# Altium project Sumobot 2007.PRJPCB
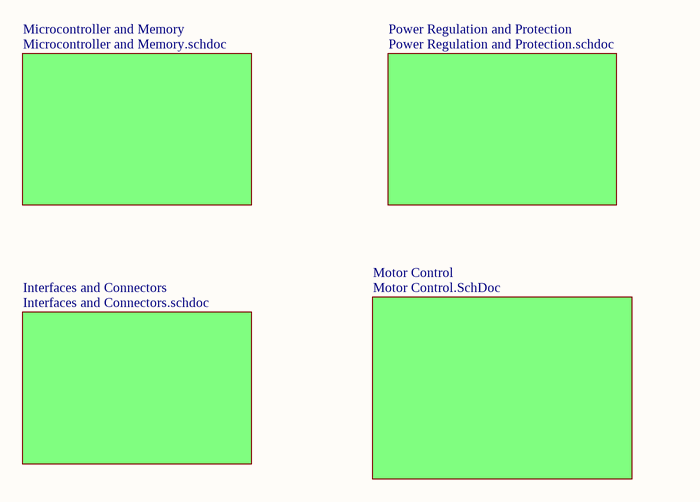
[diagram p0: Schematic of Schematics.SCHDOC]
5 sheets, 97 parts. Net scope: global (net labels, ports and power ports of the same name join across sheets).
Board files: PCB Layout.PCBDOC, SumoPCB.PcbDoc
Sheets:
  Schematic of Schematics.SCHDOC
    Microcontroller and Memory = Microcontroller and Memory.SCHDOC
    Interfaces and Connectors = Interfaces and Connectors.SCHDOC
    Power Regulation and Protection = Power Regulation and Protection.SCHDOC
    Motor Control = Motor Control.SchDoc

## Sheet Schematic of Schematics.SCHDOC
size A4

### Sub-sheets
Interfaces and Connectors = Interfaces and Connectors.schdoc: no entries
Microcontroller and Memory = Microcontroller and Memory.schdoc: no entries
Motor Control = Motor Control.SchDoc: no entries
Power Regulation and Protection = Power Regulation and Protection.schdoc: no entries

## Sheet Microcontroller and Memory.SCHDOC
size A3
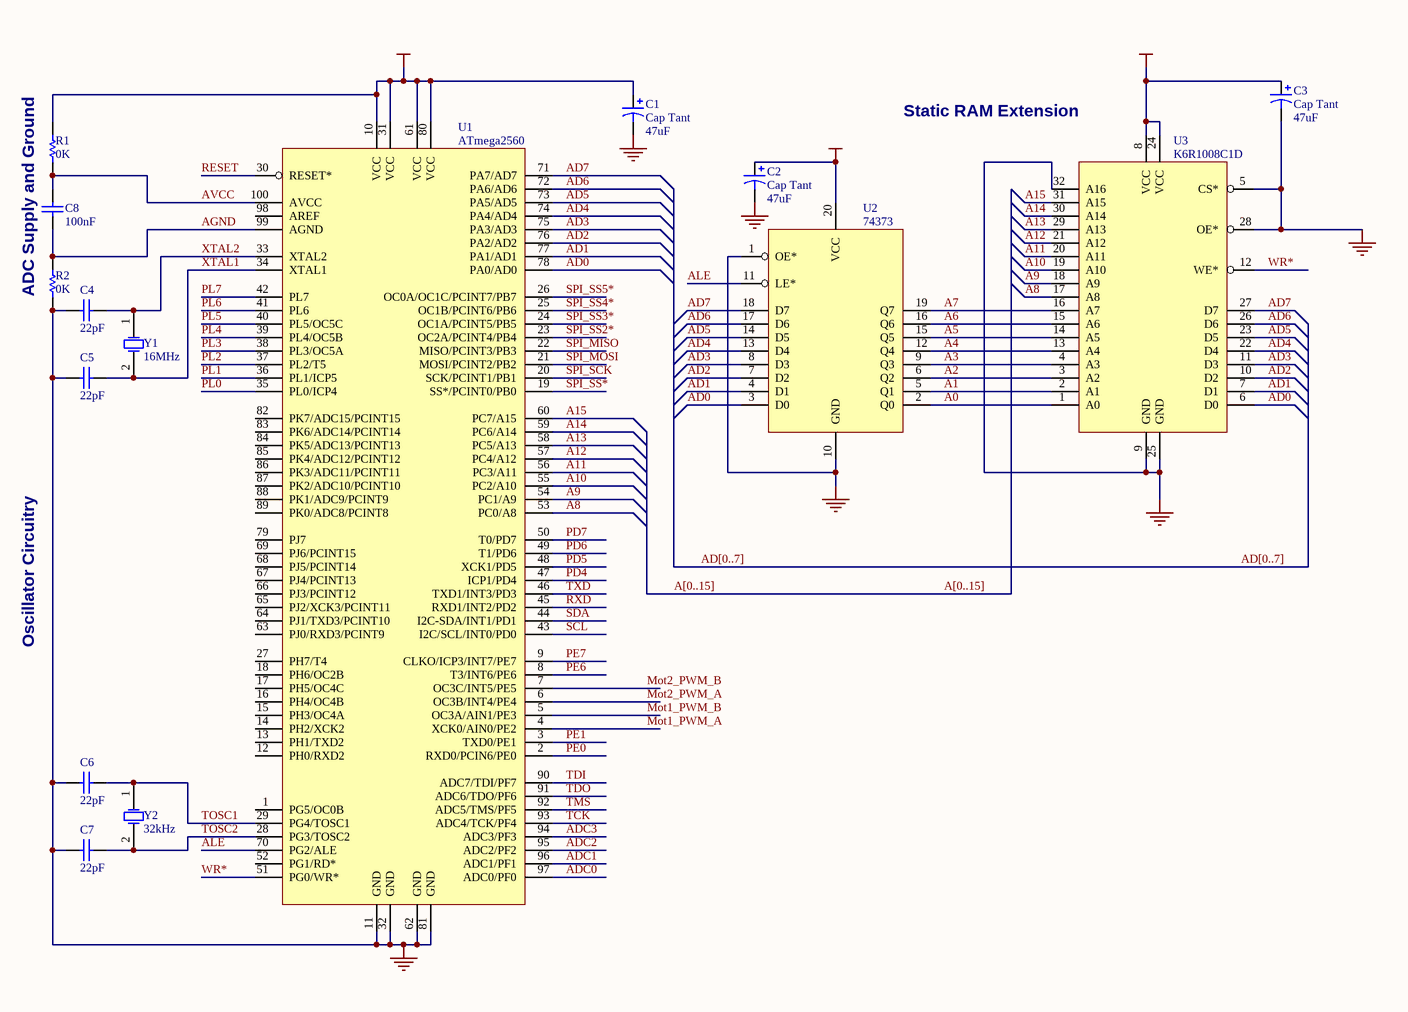
[diagram p1: Microcontroller and Memory.SCHDOC]

### Parts
C1  Cap Tant  value 47uF  [CAPR5-4X5]
C2  Cap Tant  value 47uF  [CAPR5-4X5]
C3  Cap Tant  value 47uF  [CAPR5-4X5]
C4  22pF  [BCY-W2/D3.1]
C5  22pF  [BCY-W2/D3.1]
C6  22pF  [BCY-W2/D3.1]
C7  22pF  [BCY-W2/D3.1]
C8  100nF  [BCY-W2/D3.1]
R1  0K  [AXIAL-0.3]
R2  0K  [AXIAL-0.3]
U1  ATmega2560  [F-QFP14X14-G100/Z17N]
U2  74373  [SO-G20/Y1.45]
U3  K6R1008C1D  [SO-G32/Y1.45]
Y1  16MHz  [BCY-W2/D3.1]
Y2  32kHz  [BCY-W2/D3.1]

### Nets
5V: C1.1 C2.1 C3.1 R1.2 U1.10(VCC) U1.31(VCC) U1.61(VCC) U1.80(VCC) U2.20(VCC) U3.8(VCC) U3.24(VCC)
GND: C1.2 C2.2 C3.2 C4.1 C5.1 C6.1 C7.1 R2.1 U1.11(GND) U1.32(GND) U1.62(GND) U1.81(GND) U2.1(OE*) U2.10(GND) U3.5(CS*) U3.9(GND) U3.25(GND) U3.28(OE*) U3.32(A16)
A0: U2.2(Q0) U3.1(A0)
A1: U2.5(Q1) U3.2(A1)
A2: U2.6(Q2) U3.3(A2)
A3: U2.9(Q3) U3.4(A3)
A4: U2.12(Q4) U3.13(A4)
A5: U2.15(Q5) U3.14(A5)
A6: U2.16(Q6) U3.15(A6)
A7: U2.19(Q7) U3.16(A7)
A8: U1.53(PC0/A8) U3.17(A8)
A9: U1.54(PC1/A9) U3.18(A9)
A10: U1.55(PC2/A10) U3.19(A10)
A11: U1.56(PC3/A11) U3.20(A11)
A12: U1.57(PC4/A12) U3.21(A12)
A13: U1.58(PC5/A13) U3.29(A13)
A14: U1.59(PC6/A14) U3.30(A14)
A15: U1.60(PC7/A15) U3.31(A15)
AD0: U1.78(PA0/AD0) U2.3(D0) U3.6(D0)
AD1: U1.77(PA1/AD1) U2.4(D1) U3.7(D1)
AD2: U1.76(PA2/AD2) U2.7(D2) U3.10(D2)
AD3: U1.75(PA3/AD3) U2.8(D3) U3.11(D3)
AD4: U1.74(PA4/AD4) U2.13(D4) U3.22(D4)
AD5: U1.73(PA5/AD5) U2.14(D5) U3.23(D5)
AD6: U1.72(PA6/AD6) U2.17(D6) U3.26(D6)
AD7: U1.71(PA7/AD7) U2.18(D7) U3.27(D7)
ADC0: U1.97(ADC0/PF0)
ADC1: U1.96(ADC1/PF1)
ADC2: U1.95(ADC2/PF2)
ADC3: U1.94(ADC3/PF3)
AGND: C8.2 R2.2 U1.99(AGND)
ALE: U1.70(PG2/ALE) U2.11(LE*)
AVCC: C8.1 R1.1 U1.100(AVCC)
Mot1_PWM_A: U1.4(XCK0/AIN0/PE2)
Mot1_PWM_B: U1.5(OC3A/AIN1/PE3)
Mot2_PWM_A: U1.6(OC3B/INT4/PE4)
Mot2_PWM_B: U1.7(OC3C/INT5/PE5)
PD4: U1.47(ICP1/PD4)
PD5: U1.48(XCK1/PD5)
PD6: U1.49(T1/PD6)
PD7: U1.50(T0/PD7)
PE0: U1.2(RXD0/PCIN6/PE0)
PE1: U1.3(TXD0/PE1)
PE6: U1.8(T3/INT6/PE6)
PE7: U1.9(CLKO/ICP3/INT7/PE7)
PL0: U1.35(PL0/ICP4)
PL1: U1.36(PL1/ICP5)
PL2: U1.37(PL2/T5)
PL3: U1.38(PL3/OC5A)
PL4: U1.39(PL4/OC5B)
PL5: U1.40(PL5/OC5C)
PL6: U1.41(PL6)
PL7: U1.42(PL7)
RESET: U1.30(RESET*)
RXD: U1.45(RXD1/INT2/PD2)
SCL: U1.43(I2C/SCL/INT0/PD0)
SDA: U1.44(I2C-SDA/INT1/PD1)
SPI_MISO: U1.22(MISO/PCINT3/PB3)
SPI_MOSI: U1.21(MOSI/PCINT2/PB2)
SPI_SCK: U1.20(SCK/PCINT1/PB1)
SPI_SS2*: U1.23(OC2A/PCINT4/PB4)
SPI_SS3*: U1.24(OC1A/PCINT5/PB5)
SPI_SS4*: U1.25(OC1B/PCINT6/PB6)
SPI_SS5*: U1.26(OC0A/OC1C/PCINT7/PB7)
SPI_SS*: U1.19(SS*/PCINT0/PB0)
TCK: U1.93(ADC4/TCK/PF4)
TDI: U1.90(ADC7/TDI/PF7)
TDO: U1.91(ADC6/TDO/PF6)
TMS: U1.92(ADC5/TMS/PF5)
TOSC1: C6.2 U1.29(PG4/TOSC1) Y2.1(OSC1)
TOSC2: C7.2 U1.28(PG3/TOSC2) Y2.2(OSC2)
TXD: U1.46(TXD1/INT3/PD3)
WR*: U1.51(PG0/WR*) U3.12(WE*)
XTAL1: C5.2 U1.34(XTAL1) Y1.2(OSC2)
XTAL2: C4.2 U1.33(XTAL2) Y1.1(OSC1)

Not connected (* = marked no-connect by the designer): U1 1(PG5/OC0B) 12(PH0/RXD2) 13(PH1/TXD2) 14(PH2/XCK2) 15(PH3/OC4A) 16(PH4/OC4B) 17(PH5/OC4C) 18(PH6/OC2B) 27(PH7/T4) 52(PG1/RD*) 63(PJ0/RXD3/PCINT9) 64(PJ1/TXD3/PCINT10) 65(PJ2/XCK3/PCINT11) 66(PJ3/PCINT12) 67(PJ4/PCINT13) 68(PJ5/PCINT14) 69(PJ6/PCINT15) 79(PJ7) 82(PK7/ADC15/PCINT15) 83(PK6/ADC14/PCINT14) 84(PK5/ADC13/PCINT13) 85(PK4/ADC12/PCINT12) 86(PK3/ADC11/PCINT11) 87(PK2/ADC10/PCINT10) 88(PK1/ADC9/PCINT9) 89(PK0/ADC8/PCINT8) 98(AREF)

### Buses and harness runs
bus A[0..15]
bus AD[0..7]

### Notes on the sheet
- (near U3) Static RAM Extension
- ADC Supply and Ground
- Oscillator Circuitry

### Library data of the parts
C1-C3 = Cap Pol2: Polarized Capacitor (Axial); Published: 8-Jun-2000; Revision: July-2002: Re-released for DXP Platform.; Publisher: Altium Limited
C4-C8 = Cap: Capacitor; Published: 8-Jun-2000; Revision: July-2002: Re-released for DXP Platform.; Publisher: Altium Limited
R1 R2 = Res1: Resistor; Published: 8-Jun-2000; Revision: July-2002: Re-released for DXP Platform.; Publisher: Altium Limited
U1 = ATmega2560: Atmel ATmega2560 MCU
U2 = 74373: Octal 8-bit D-type Latch
U3 = K6R1008C1D: Samsung 128Kx8 High-Speed Static RAM
Y1 Y2 = XTAL: Crystal Oscillator; Published: 8-Jun-2000; Revision: July-2002: Re-released for DXP Platform.; Publisher: Altium Limited

## Sheet Interfaces and Connectors.SCHDOC
size A4
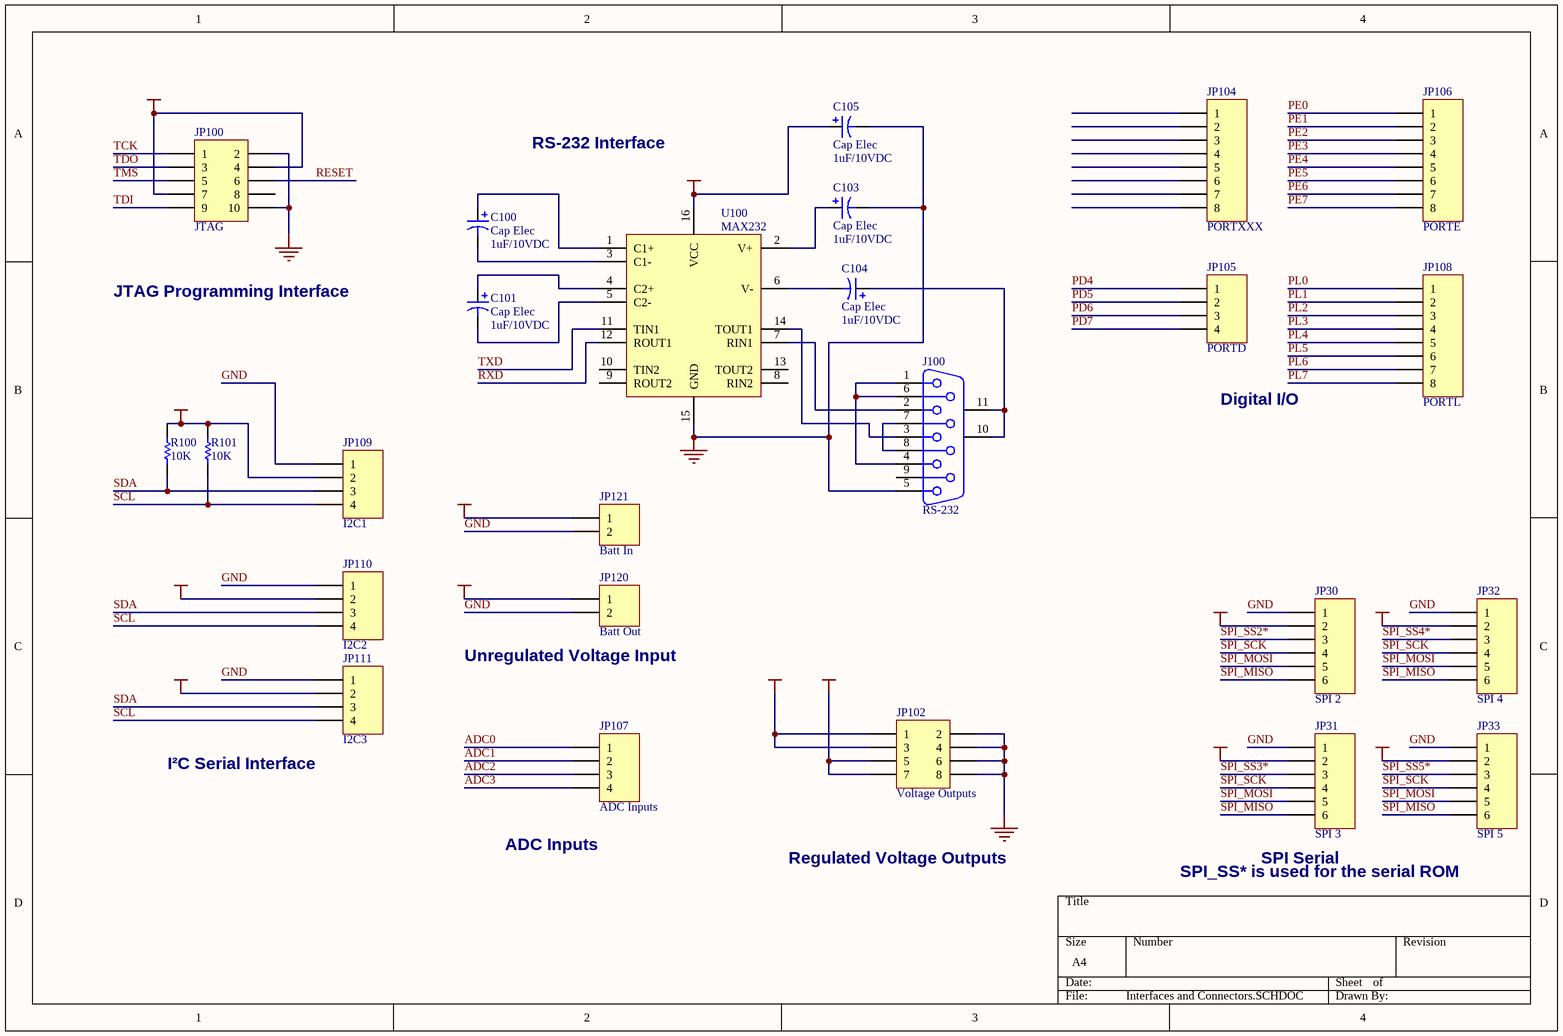
[diagram p2: Interfaces and Connectors.SCHDOC]

### Parts
C100  Cap Elec  value 1uF/10VDC  [CAPR5-4X5]
C101  Cap Elec  value 1uF/10VDC  [CAPR5-4X5]
C103  Cap Elec  value 1uF/10VDC  [CAPR5-4X5]
C104  Cap Elec  value 1uF/10VDC  [CAPR5-4X5]
C105  Cap Elec  value 1uF/10VDC  [CAPR5-4X5]
J100  RS-232  [DSUB1.385-2H9]
JP30  SPI 2  [HDR1X6]
JP31  SPI 3  [HDR1X6]
JP32  SPI 4  [HDR1X6]
JP33  SPI 5  [HDR1X6]
JP100  JTAG  [HDR2X5]
JP102  Voltage Outputs  [HDR2X4]
JP104  PORTXXX  [HDR1X8]
JP105  PORTD  [HDR1X4]
JP106  PORTE  [HDR1X8]
JP107  ADC Inputs  [HDR1X4]
JP108  PORTL  [HDR1X8]
JP109  I2C1  [HDR1X4]
JP110  I2C2  [HDR1X4]
JP111  I2C3  [HDR1X4]
JP120  Batt Out  [HDR1X2]
JP121  Batt In  [HDR1X2]
R100  10K  [AXIAL-0.3]
R101  10K  [AXIAL-0.3]
U100  MAX232  [SO-G16/C5.85]

### Nets
5V: C105.1 JP30.2 JP31.2 JP32.2 JP33.2 JP100.4 JP100.7 JP102.5 JP102.7 JP109.2 JP110.2 JP111.2 R100.2 R101.2 U100.16(VCC)
9V: JP102.1 JP102.3
GND: C103.2 C105.2 J100.5 JP30.1 JP31.1 JP32.1 JP33.1 JP100.2 JP100.10 JP102.2 JP102.4 JP102.6 JP102.8 JP109.1 JP110.1 JP111.1 JP120.2 JP121.2 U100.15(GND)
VBat: JP120.1 JP121.1
ADC0: JP107.1
ADC1: JP107.2
ADC2: JP107.3
ADC3: JP107.4
PD4: JP105.1
PD5: JP105.2
PD6: JP105.3
PD7: JP105.4
PE0: JP106.1
PE1: JP106.2
PE2: JP106.3
PE3: JP106.4
PE4: JP106.5
PE5: JP106.6
PE6: JP106.7
PE7: JP106.8
PL0: JP108.1
PL1: JP108.2
PL2: JP108.3
PL3: JP108.4
PL4: JP108.5
PL5: JP108.6
PL6: JP108.7
PL7: JP108.8
RESET: JP100.6
RXD: U100.12(ROUT1)
SCL: JP109.4 JP110.4 JP111.4 R101.1
SDA: JP109.3 JP110.3 JP111.3 R100.1
SPI_MISO: JP30.6 JP31.6 JP32.6 JP33.6
SPI_MOSI: JP30.5 JP31.5 JP32.5 JP33.5
SPI_SCK: JP30.4 JP31.4 JP32.4 JP33.4
SPI_SS2*: JP30.3
SPI_SS3*: JP31.3
SPI_SS4*: JP32.3
SPI_SS5*: JP33.3
TCK: JP100.1
TDI: JP100.9
TDO: JP100.3
TMS: JP100.5
TXD: U100.11(TIN1)
NetC100_1: C100.1 U100.1(C1+)
NetC100_2: C100.2 U100.3(C1-)
NetC101_1: C101.1 U100.4(C2+)
NetC101_2: C101.2 U100.5(C2-)
NetC103_1: C103.1 U100.2(V+)
NetC104_1: C104.1 J100.10(MH1) J100.11(MH2)
NetC104_2: C104.2 U100.6(V-)
NetJ100_1: J100.1 J100.4 J100.6
NetJ100_2: J100.2 U100.7(RIN1)
NetJ100_3: J100.3 U100.14(TOUT1)
NetJ100_7: J100.7 J100.8

Not connected (* = marked no-connect by the designer): J100 9; JP100 8; JP104 1 2 3 4 5 6 7 8; U100 8(RIN2) 9(ROUT2) 10(TIN2) 13(TOUT2)

### Notes on the sheet
- RS-232 Interface
- JTAG Programming Interface
- Digital I/O
- (near JP120) Unregulated Voltage Input
- (near JP111) I²C Serial Interface
- (near JP107) ADC Inputs
- Regulated Voltage Outputs
- SPI_SS* is used for the serial ROM
- (near JP31) SPI Serial

### Library data of the parts
C100 C101 C103-C105 = Cap Pol2: Polarized Capacitor (Axial); Published: 8-Jun-2000; Revision: July-2002: Re-released for DXP Platform.; Publisher: Altium Limited
J100 = D Connector 9: Receptacle Assembly, 9 Position, Right Angle; Package Information: Latest Revision: O; Positions: 9; Published: 15-Jun-2001; Revision: 17-Jul-2002: Re-released for DXP Platform.; Datasheet: (1-Sep-1999); Package Reference: 788750; Publisher: Altium Limited; Orientation: Right Angle; Gender: Receptacle
JP30-JP33 = Header 6: Header, 6-Pin; Revision: 17-Jul-2002: Re-released for DXP Platform.; Publisher: Altium Limited
JP100 = Header 5X2: Header, 5-Pin, Dual row; Revision: 17-Jul-2002: Re-released for DXP Platform.; Publisher: Altium Limited
JP102 = Header 4X2: Header, 4-Pin, Dual row; Revision: 17-Jul-2002: Re-released for DXP Platform.; Publisher: Altium Limited
JP104 JP106 JP108 = Header 8: Header, 8-Pin; Revision: 17-Jul-2002: Re-released for DXP Platform.; Publisher: Altium Limited
JP105 JP107 JP109-JP111 = Header 4: Header, 4-Pin; Revision: 17-Jul-2002: Re-released for DXP Platform.; Publisher: Altium Limited
JP120 JP121 = Header 2: Header, 2-Pin; Revision: 17-Jul-2002: Re-released for DXP Platform.; Publisher: Altium Limited
R100 R101 = Res1: Resistor; Published: 8-Jun-2000; Revision: July-2002: Re-released for DXP Platform.; Publisher: Altium Limited
U100 = MAX232: Maxim RS-232 Transceiver

## Sheet Power Regulation and Protection.SCHDOC
size A4
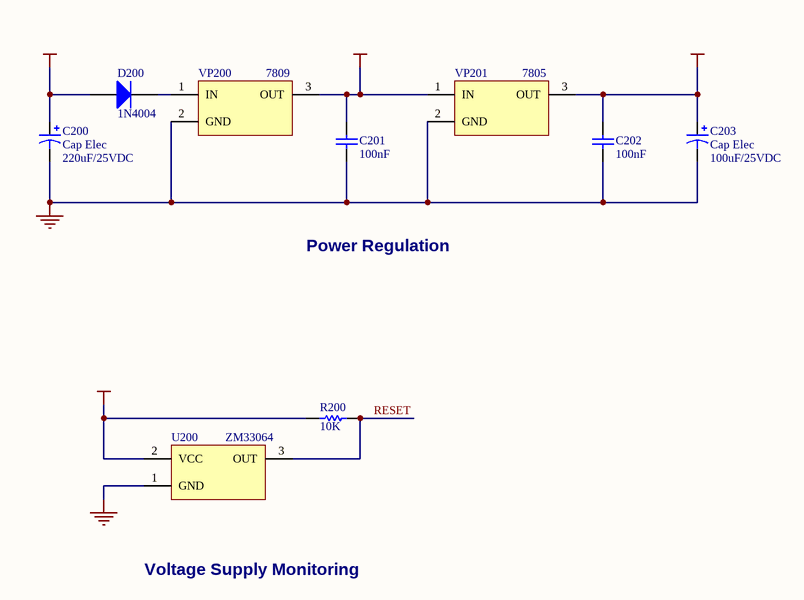
[diagram p3: Power Regulation and Protection.SCHDOC]

### Parts
C200  Cap Elec  value 220uF/25VDC  [CAPR5-4X5]
C201  100nF  [BCY-W2/D3.1]
C202  100nF  [BCY-W2/D3.1]
C203  Cap Elec  value 100uF/25VDC  [CAPR5-4X5]
D200  1N4004  [DIO10.46-5.3x2.8]
R200  10K  [AXIAL-0.3]
U200  ZM33064  [BCY-W3]
VP200  7809  [PIN3]
VP201  7805  [PIN3]

### Nets
5V: C202.2 C203.1 R200.2 U200.2(VCC) VP201.3(OUT)
9V: C201.2 VP200.3(OUT) VP201.1(IN)
GND: C200.2 C201.1 C202.1 C203.2 U200.1(GND) VP200.2(GND) VP201.2(GND)
VBat: C200.1 D200.1(A)
RESET: R200.1 U200.3(OUT)
NetD200_2: D200.2(K) VP200.1(IN)

### Notes on the sheet
- Power Regulation
- Voltage Supply Monitoring

### Library data of the parts
C200 C203 = Cap Pol2: Polarized Capacitor (Axial); Published: 8-Jun-2000; Revision: July-2002: Re-released for DXP Platform.; Publisher: Altium Limited
C201 C202 = Cap: Capacitor; Published: 8-Jun-2000; Revision: July-2002: Re-released for DXP Platform.; Publisher: Altium Limited
D200 = Diode 1N4004: 1 Amp General Purpose Rectifier; Revision 1: 11-Jul-2000: SIM Model Added.; Revision 2: 17-Jul-2002: Re-released for DXP Platform.; Package Information: Latest Revision: Aug-1999; Code - JEDEC: DO-204-AL; Published: 8-Jun-2000; Datasheet: Latest Revision: 1998; Package Reference: DO-41; Publisher: Altium Limited
R200 = Res1: Resistor; Published: 8-Jun-2000; Revision: July-2002: Re-released for DXP Platform.; Publisher: Altium Limited
U200 = ZM33064: Generic 5V Supply Voltage Monitor
VP200 = 7809: Generic 9V Voltage Regulator
VP201 = 7805: Generic 6V Voltage Regulator

## Sheet Motor Control.SchDoc
size A3
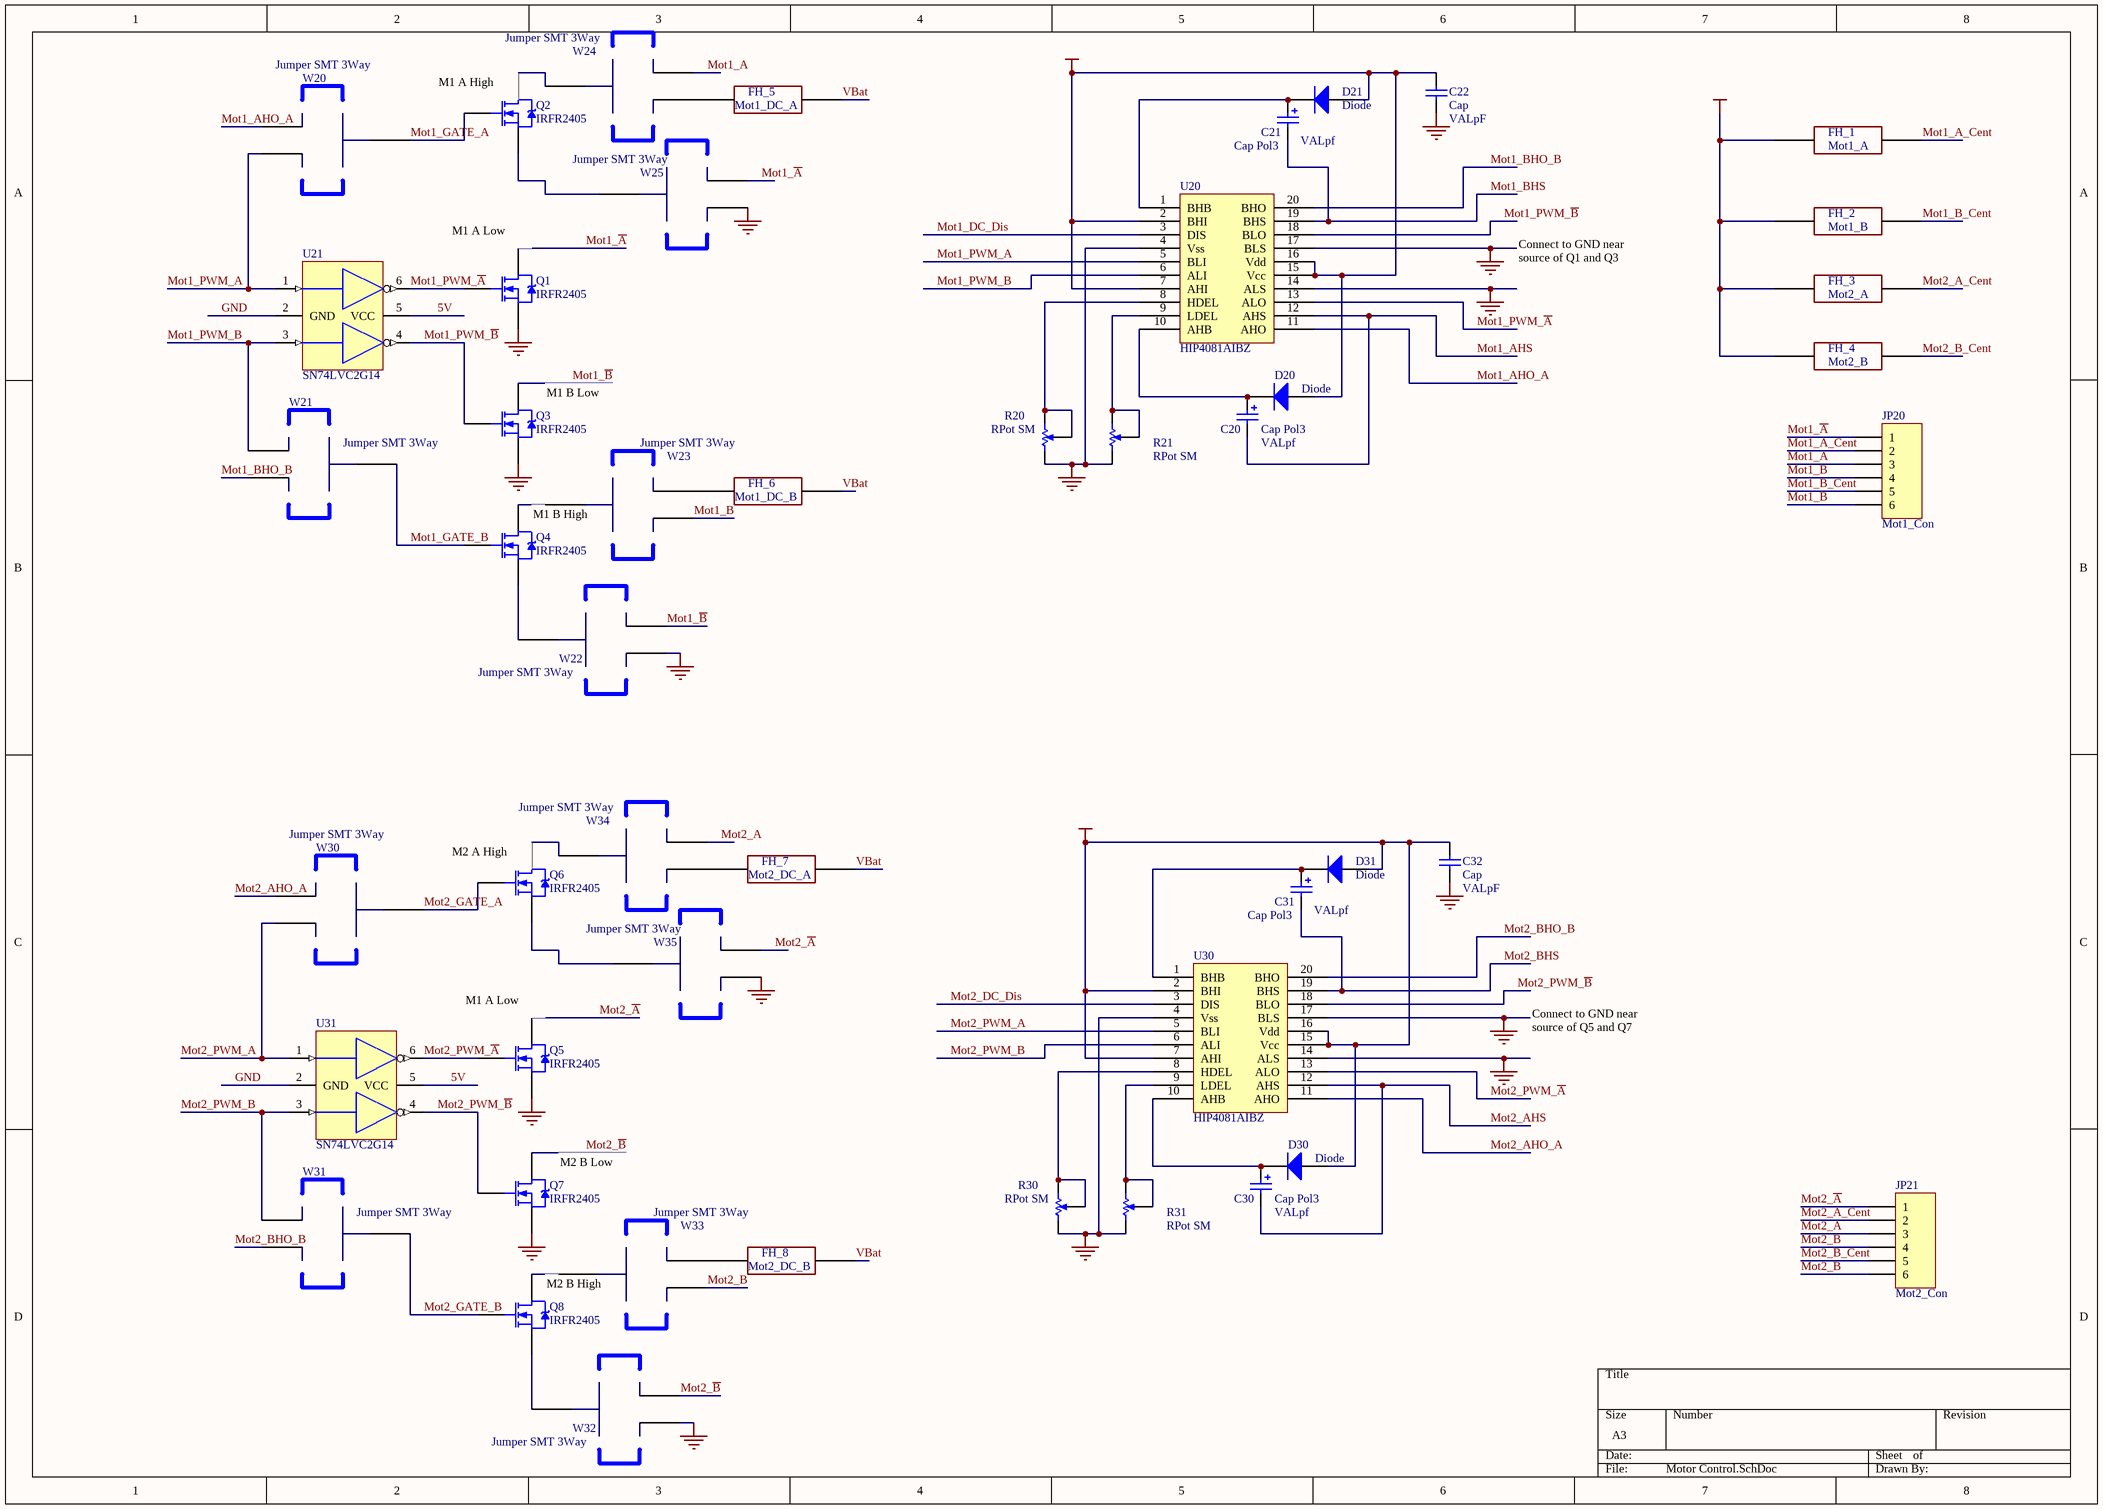
[diagram p4: Motor Control.SchDoc]

### Parts
C20  Cap Pol3  value VALpf  [CC2012-0805]
C21  Cap Pol3  value VALpf  [CC2012-0805]
C22  Cap  value VALpF  [RAD-0.3]
C30  Cap Pol3  value VALpf  [CC2012-0805]
C31  Cap Pol3  value VALpf  [CC2012-0805]
C32  Cap  value VALpF  [RAD-0.3]
D20  Diode  [DSO-C2/X3.3]
D21  Diode  [DSO-C2/X3.3]
D30  Diode  [DSO-C2/X3.3]
D31  Diode  [DSO-C2/X3.3]
FH_1  Mot1_A
FH_2  Mot1_B
FH_3  Mot2_A
FH_4  Mot2_B
FH_5  Mot1_DC_A
FH_6  Mot1_DC_B
FH_7  Mot2_DC_A
FH_8  Mot2_DC_B
JP20  Mot1_Con  [HDR1X6]
JP21  Mot2_Con  [HDR1X6]
Q1  IRFR2405  [TO-252AA]
Q2  IRFR2405  [TO-252AA]
Q3  IRFR2405  [TO-252AA]
Q4  IRFR2405  [TO-252AA]
Q5  IRFR2405  [TO-252AA]
Q6  IRFR2405  [TO-252AA]
Q7  IRFR2405  [TO-252AA]
Q8  IRFR2405  [TO-252AA]
R20  RPot SM  [POT4MM-2]
R21  RPot SM  [POT4MM-2]
R30  RPot SM  [POT4MM-2]
R31  RPot SM  [POT4MM-2]
U20  HIP4081AIBZ  [SOIC20A]
U21  SN74LVC2G14  [SC70]
U30  HIP4081AIBZ  [SOIC20A]
U31  SN74LVC2G14  [SC70]
W20  Jumper SMT 3Way  [Jumper SMT 3 Way]
W21  Jumper SMT 3Way  [Jumper SMT 3 Way]
W22  Jumper SMT 3Way  [Jumper SMT 3 Way]
W23  Jumper SMT 3Way  [Jumper SMT 3 Way]
W24  Jumper SMT 3Way  [Jumper SMT 3 Way]
W25  Jumper SMT 3Way  [Jumper SMT 3 Way]
W30  Jumper SMT 3Way  [Jumper SMT 3 Way]
W31  Jumper SMT 3Way  [Jumper SMT 3 Way]
W32  Jumper SMT 3Way  [Jumper SMT 3 Way]
W33  Jumper SMT 3Way  [Jumper SMT 3 Way]
W34  Jumper SMT 3Way  [Jumper SMT 3 Way]
W35  Jumper SMT 3Way  [Jumper SMT 3 Way]

### Nets
5V: U21.5(VCC) U31.5(VCC)
12V: C22.2 C32.2 D20.1(A) D21.1(A) D30.1(A) D31.1(A) U20.2(BHI) U20.7(AHI) U20.15(Vcc) U20.16(Vdd) U30.2(BHI) U30.7(AHI) U30.15(Vcc) U30.16(Vdd)
GND: C22.1 C32.1 Q1.3(S) Q3.3(S) Q5.3(S) Q7.3(S) R20.CCW(-) R21.CCW(-) R30.CCW(-) R31.CCW(-) U20.4(Vss) U20.14(ALS) U20.17(BLS) U21.2(GND) U30.4(Vss) U30.14(ALS) U30.17(BLS) U31.2(GND) W22.3(Out2) W25.3(Out2) W32.3(Out2) W35.3(Out2)
VBat: FH_1.1 FH_2.1 FH_3.1 FH_4.1 FH_5.2 FH_6.2 FH_7.2 FH_8.2
Mot1_A: JP20.3 W24.2(Out1)
Mot1_~{A}: JP20.1 Q1.4(D) W25.2(Out1)
Mot1_A_Cent: FH_1.2 JP20.2
Mot1_AHO_A: U20.11(AHO) W20.3(Out2)
Mot1_AHS: C20.2 U20.12(AHS)
Mot1_B: JP20.6 W23.3(Out2)
Mot1_~{B}: JP20.4 Q3.4(D) W22.2(Out1)
Mot1_B_Cent: FH_2.2 JP20.5
Mot1_BHO_B: U20.20(BHO) W21.2(Out1)
Mot1_BHS: C21.2 U20.19(BHS)
Mot1_DC_Dis: U20.3(DIS)
Mot1_GATE_A: Q2.1(G) W20.1(In)
Mot1_GATE_B: Q4.1(G) W21.1(In)
Mot1_PWM_A: U20.5(BLI) U21.1(A) W20.2(Out1)
Mot1_PWM_~{A}: Q1.1(G) U20.13(ALO) U21.6(Y)
Mot1_PWM_B: U20.6(ALI) U21.3(A) W21.3(Out2)
Mot1_PWM_~{B}: Q3.1(G) U20.18(BLO) U21.4(Y)
Mot2_A: JP21.3 W34.2(Out1)
Mot2_~{A}: JP21.1 Q5.4(D) W35.2(Out1)
Mot2_A_Cent: FH_3.2 JP21.2
Mot2_AHO_A: U30.11(AHO) W30.3(Out2)
Mot2_AHS: C30.2 U30.12(AHS)
Mot2_B: JP21.6 W33.3(Out2)
Mot2_~{B}: JP21.4 Q7.4(D) W32.2(Out1)
Mot2_B_Cent: FH_4.2 JP21.5
Mot2_BHO_B: U30.20(BHO) W31.2(Out1)
Mot2_BHS: C31.2 U30.19(BHS)
Mot2_DC_Dis: U30.3(DIS)
Mot2_GATE_A: Q6.1(G) W30.1(In)
Mot2_GATE_B: Q8.1(G) W31.1(In)
Mot2_PWM_A: U30.5(BLI) U31.1(A) W30.2(Out1)
Mot2_PWM_~{A}: Q5.1(G) U30.13(ALO) U31.6(Y)
Mot2_PWM_B: U30.6(ALI) U31.3(A) W31.3(Out2)
Mot2_PWM_~{B}: Q7.1(G) U30.18(BLO) U31.4(Y)
NetC20_1: C20.1 D20.2(K) U20.10(AHB)
NetC21_1: C21.1 D21.2(K) U20.1(BHB)
NetC30_1: C30.1 D30.2(K) U30.10(AHB)
NetC31_1: C31.1 D31.2(K) U30.1(BHB)
NetFH_5_1: FH_5.1 W24.3(Out2)
NetFH_6_1: FH_6.1 W23.2(Out1)
NetFH_7_1: FH_7.1 W34.3(Out2)
NetFH_8_1: FH_8.1 W33.2(Out1)
NetQ2_3: Q2.3(S) W25.1(In)
NetQ2_4: Q2.4(D) W24.1(In)
NetQ4_3: Q4.3(S) W22.1(In)
NetQ4_4: Q4.4(D) W23.1(In)
NetQ6_3: Q6.3(S) W35.1(In)
NetQ6_4: Q6.4(D) W34.1(In)
NetQ8_3: Q8.3(S) W32.1(In)
NetQ8_4: Q8.4(D) W33.1(In)
NetR20_CW: R20.CW(+) R20.W U20.8(HDEL)
NetR21_CW: R21.CW(+) R21.W U20.9(LDEL)
NetR30_CW: R30.CW(+) R30.W U30.8(HDEL)
NetR31_CW: R31.CW(+) R31.W U30.9(LDEL)

### Notes on the sheet
- (near Q2) M1 A High
- (near Q1) M1 A Low
- Connect to GND near source of Q1 and Q3
- (near Q3) M1 B Low
- (near W23) M1 B High
- (near Q6) M2 A High
- (near Q5) M1 A Low
- Connect to GND near source of Q5 and Q7
- (near Q7) M2 B Low
- (near W33) M2 B High

### Library data of the parts
C20 C21 C30 C31 = Cap Pol3: Polarized Capacitor (Surface Mount); Published: 8-Jun-2000; Revision: July-2002: Re-released for DXP Platform.; Publisher: Altium Limited
C22 C32 = Cap: Capacitor; Published: 8-Jun-2000; Revision: July-2002: Re-released for DXP Platform.; Publisher: Altium Limited
D20 D21 D30 D31 = Diode: Default Diode; Code - JEDEC: DO-214-AB; Published: 8-Jun-2000; Revision: July-2002: Re-released for DXP Platform.; Publisher: Altium Limited
FH_1-FH_8 = Fuse_Holder: Fuse Holder
JP20 JP21 = Header 6: Header, 6-Pin; Revision: 17-Jul-2002: Re-released for DXP Platform.; Publisher: Altium Limited
Q1-Q8 = IRFR2405: HEXFET Power MOSFET; Note: Pin 2 is trimmed and not drawn; Code - JEDEC: TO-252-AA; Published: 17-Sep-2003; Datasheet: Latest Revision: 1-Mar-2000; Package Reference: TO-252AA; Publisher: Altium Limited
R20 R21 R30 R31 = RPot SM: Square Trimming Potentiometer; Published: 17-Dec-2003; Datasheet: Latest Revision: Oct-2003; Publisher: Altium Limited
U20 U30 = HIP4081AIBZ: 80V/2.5A Peak, High Frequency Full Bridge FET Driver
U21 U31 = SN74LVC2G14: Dual Schmitt-Trigger Inverter; Package Information: Latest Revision: May-1999; Code - JEDEC: MO-203; Published: 8-Jun-2000; Revision: 17-Jul-2002: Re-released for DXP Platform.; Datasheet: Latest Revision: Jul-1995; Package Reference: DB014; Publisher: Altium Limited

## Nets that join several sheets
5V: Microcontroller and Memory (11 pins), Interfaces and Connectors (15 pins), Power Regulation and Protection (5 pins), Motor Control (U21.5 U31.5)
9V: Interfaces and Connectors (JP102.1 JP102.3), Power Regulation and Protection (C201.2 VP200.3 VP201.1)
GND: Microcontroller and Memory (19 pins), Interfaces and Connectors (19 pins), Power Regulation and Protection (7 pins), Motor Control (22 pins)
VBat: Interfaces and Connectors (JP120.1 JP121.1), Power Regulation and Protection (C200.1 D200.1), Motor Control (8 pins)
ADC0: Microcontroller and Memory (U1.97), Interfaces and Connectors (JP107.1)
ADC1: Microcontroller and Memory (U1.96), Interfaces and Connectors (JP107.2)
ADC2: Microcontroller and Memory (U1.95), Interfaces and Connectors (JP107.3)
ADC3: Microcontroller and Memory (U1.94), Interfaces and Connectors (JP107.4)
Mot1_PWM_A: Microcontroller and Memory (U1.4), Motor Control (U20.5 U21.1 W20.2)
Mot1_PWM_B: Microcontroller and Memory (U1.5), Motor Control (U20.6 U21.3 W21.3)
Mot2_PWM_A: Microcontroller and Memory (U1.6), Motor Control (U30.5 U31.1 W30.2)
Mot2_PWM_B: Microcontroller and Memory (U1.7), Motor Control (U30.6 U31.3 W31.3)
PD4: Microcontroller and Memory (U1.47), Interfaces and Connectors (JP105.1)
PD5: Microcontroller and Memory (U1.48), Interfaces and Connectors (JP105.2)
PD6: Microcontroller and Memory (U1.49), Interfaces and Connectors (JP105.3)
PD7: Microcontroller and Memory (U1.50), Interfaces and Connectors (JP105.4)
PE0: Microcontroller and Memory (U1.2), Interfaces and Connectors (JP106.1)
PE1: Microcontroller and Memory (U1.3), Interfaces and Connectors (JP106.2)
PE6: Microcontroller and Memory (U1.8), Interfaces and Connectors (JP106.7)
PE7: Microcontroller and Memory (U1.9), Interfaces and Connectors (JP106.8)
PL0: Microcontroller and Memory (U1.35), Interfaces and Connectors (JP108.1)
PL1: Microcontroller and Memory (U1.36), Interfaces and Connectors (JP108.2)
PL2: Microcontroller and Memory (U1.37), Interfaces and Connectors (JP108.3)
PL3: Microcontroller and Memory (U1.38), Interfaces and Connectors (JP108.4)
PL4: Microcontroller and Memory (U1.39), Interfaces and Connectors (JP108.5)
PL5: Microcontroller and Memory (U1.40), Interfaces and Connectors (JP108.6)
PL6: Microcontroller and Memory (U1.41), Interfaces and Connectors (JP108.7)
PL7: Microcontroller and Memory (U1.42), Interfaces and Connectors (JP108.8)
RESET: Microcontroller and Memory (U1.30), Interfaces and Connectors (JP100.6), Power Regulation and Protection (R200.1 U200.3)
RXD: Microcontroller and Memory (U1.45), Interfaces and Connectors (U100.12)
SCL: Microcontroller and Memory (U1.43), Interfaces and Connectors (JP109.4 JP110.4 JP111.4 R101.1)
SDA: Microcontroller and Memory (U1.44), Interfaces and Connectors (JP109.3 JP110.3 JP111.3 R100.1)
SPI_MISO: Microcontroller and Memory (U1.22), Interfaces and Connectors (JP30.6 JP31.6 JP32.6 JP33.6)
SPI_MOSI: Microcontroller and Memory (U1.21), Interfaces and Connectors (JP30.5 JP31.5 JP32.5 JP33.5)
SPI_SCK: Microcontroller and Memory (U1.20), Interfaces and Connectors (JP30.4 JP31.4 JP32.4 JP33.4)
SPI_SS2*: Microcontroller and Memory (U1.23), Interfaces and Connectors (JP30.3)
SPI_SS3*: Microcontroller and Memory (U1.24), Interfaces and Connectors (JP31.3)
SPI_SS4*: Microcontroller and Memory (U1.25), Interfaces and Connectors (JP32.3)
SPI_SS5*: Microcontroller and Memory (U1.26), Interfaces and Connectors (JP33.3)
TCK: Microcontroller and Memory (U1.93), Interfaces and Connectors (JP100.1)
TDI: Microcontroller and Memory (U1.90), Interfaces and Connectors (JP100.9)
TDO: Microcontroller and Memory (U1.91), Interfaces and Connectors (JP100.3)
TMS: Microcontroller and Memory (U1.92), Interfaces and Connectors (JP100.5)
TXD: Microcontroller and Memory (U1.46), Interfaces and Connectors (U100.11)